# EAGLE schematic toyotune_3s_lvc_dil28 (EAGLE 5.11)

## Sheet 1 of 4
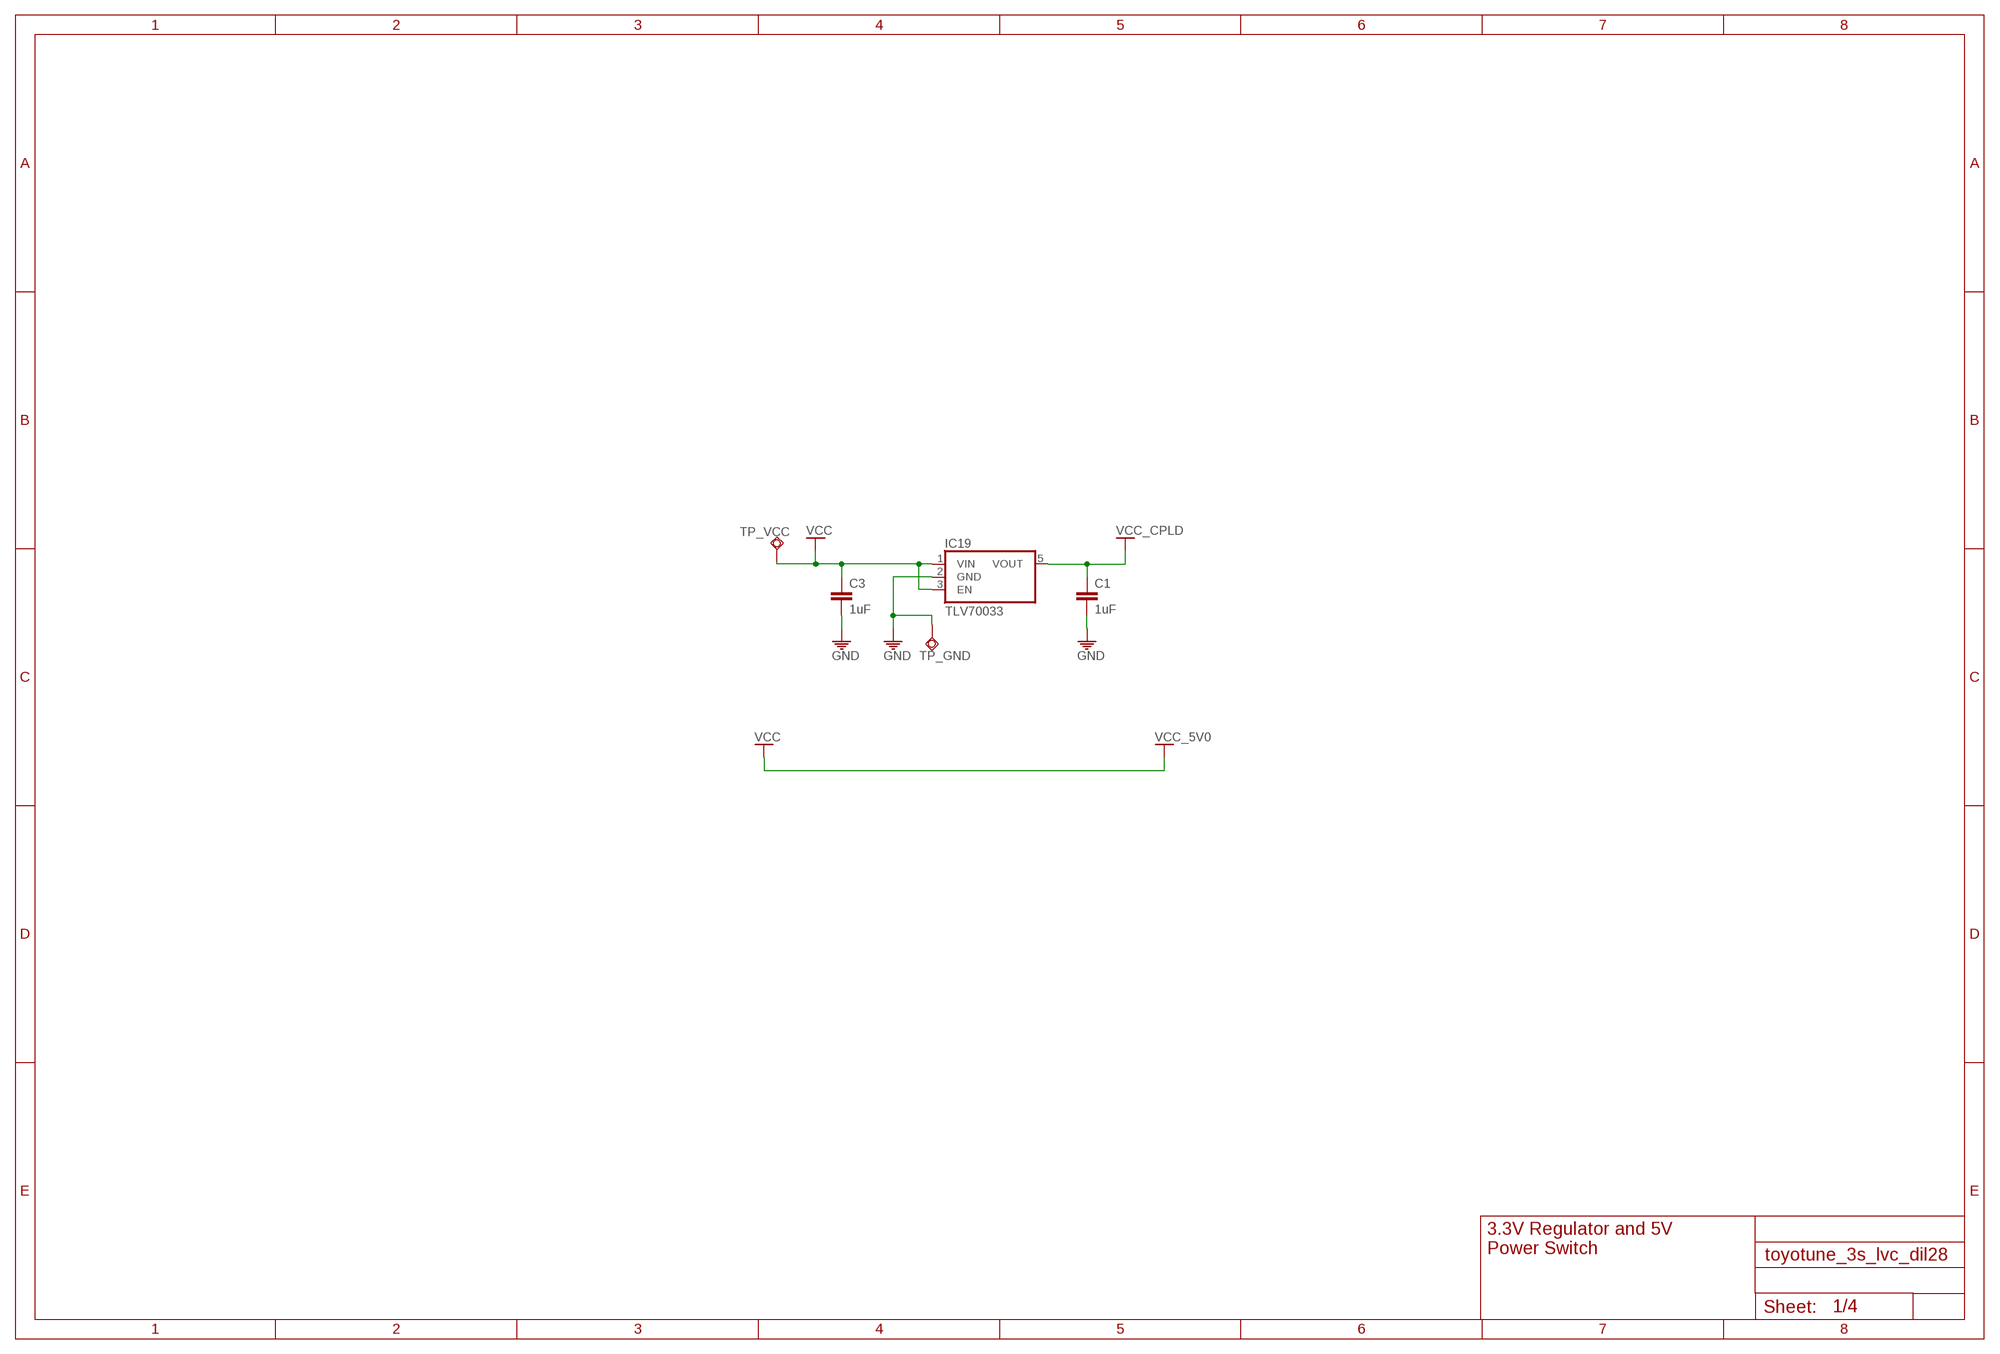
[diagram p0: schematic, sheet 1]

### Parts
C1  1uF  C-EUC0603  [C0603]
C3  1uF  C-EUC0603  [C0603]
IC19  TLV70033  [DDC_R-PDSO-G5]
TP_GND  TPSQTP12SQ  [TP12SQ]
TP_VCC  TPSQTP12SQ  [TP12SQ]

### Nets
GND: C1.2 C3.2 IC19.2(GND) TP_GND.TP ; also sheet 2,3,4
VCC: C3.1 IC19.1(VIN) IC19.3(EN) TP_VCC.TP ; supply symbol labelled VCC_5V0 ; also sheet 2,3,4
VCC_CPLD: C1.1 IC19.5(VOUT) ; also sheet 3,4

### Notes on the sheet
- 3.3V Regulator and 5V
- Power Switch

## Sheet 2 of 4
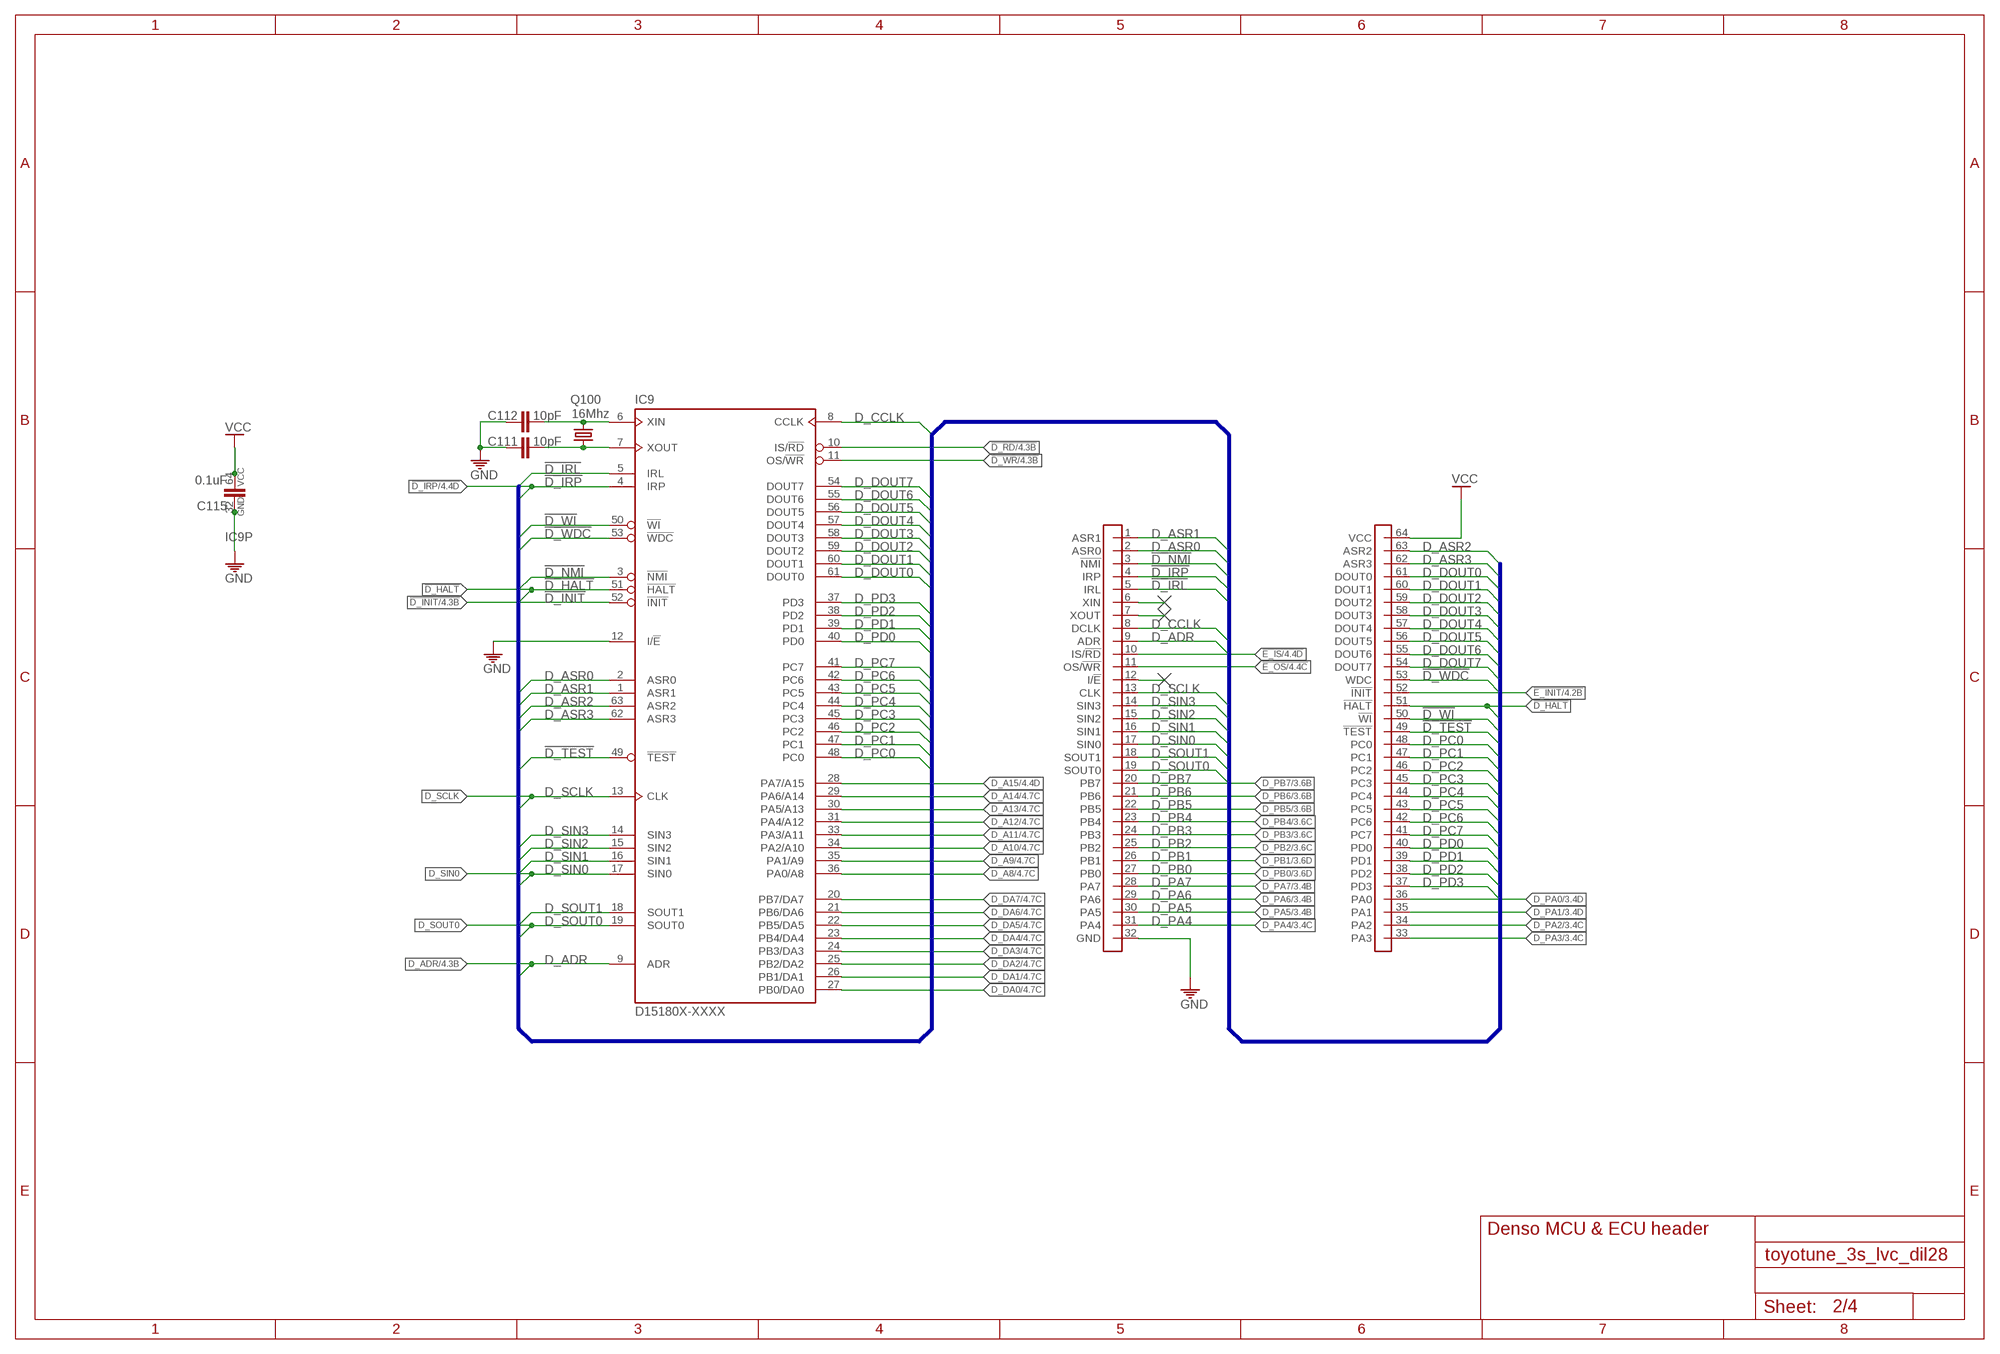
[diagram p1: schematic, sheet 2]

### Parts
C111  10pF  C-EUC0603  [C0603]
C112  10pF  C-EUC0603  [C0603]
C115  0.1uF  C-EUC0603  [C0603]
IC9  D15180X-XXXX  D151803-9661  [SDIP-64]
Q100  16Mhz  CRYSTAL5X3  [CRYSTAL-SMD-5X3]
U1  D151803-CONN  [SDIP-64-CONN]

### Nets
!D_HALT: IC9.51(:!HALT) U1.51(!HALT)
!D_INIT: IC9.52(:!INIT) ; also sheet 4
!D_IRL: IC9.5(:IRL) U1.5(IRL)
!D_IRP: IC9.4(:IRP) U1.4(IRP) ; also sheet 4
!D_NMI: IC9.3(:!NMI) U1.3(!NMI)
!D_RD: IC9.10(:IS/!RD) ; also sheet 4
!D_TEST: IC9.49(:!TEST) U1.49(!TEST)
!D_WDC: IC9.53(:!WDC) U1.53(WDC)
!D_WI: IC9.50(:!WI) U1.50(!WI)
!D_WR: IC9.11(:OS/!WR) ; also sheet 4
!E_INIT: U1.52(!INIT) ; also sheet 4
!E_IS: U1.10(IS/!RD) ; also sheet 4
!E_OS: U1.11(OS/!WR) ; also sheet 4
D1_XIN: C112.2 IC9.6(:XIN) Q100.3
D1_XOUT: C111.1 IC9.7(:XOUT) Q100.1
D_A8: IC9.36(:PA0/A8) ; also sheet 4
D_A9: IC9.35(:PA1/A9) ; also sheet 4
D_A10: IC9.34(:PA2/A10) ; also sheet 4
D_A11: IC9.33(:PA3/A11) ; also sheet 4
D_A12: IC9.31(:PA4/A12) ; also sheet 4
D_A13: IC9.30(:PA5/A13) ; also sheet 4
D_A14: IC9.29(:PA6/A14) ; also sheet 4
D_A15: IC9.28(:PA7/A15) ; also sheet 4
D_ADR: IC9.9(:ADR) U1.9(ADR) ; also sheet 4
D_ASR0: IC9.2(:ASR0) U1.2(ASR0)
D_ASR1: IC9.1(:ASR1) U1.1(ASR1)
D_ASR2: IC9.63(:ASR2) U1.63(ASR2)
D_ASR3: IC9.62(:ASR3) U1.62(ASR3)
D_CCLK: IC9.8(:CCLK) U1.8(DCLK) ; also sheet 4
D_DA0: IC9.27(:PB0/DA0) ; also sheet 4
D_DA1: IC9.26(:PB1/DA1) ; also sheet 4
D_DA2: IC9.25(:PB2/DA2) ; also sheet 4
D_DA3: IC9.24(:PB3/DA3) ; also sheet 4
D_DA4: IC9.23(:PB4/DA4) ; also sheet 4
D_DA5: IC9.22(:PB5/DA5) ; also sheet 4
D_DA6: IC9.21(:PB6/DA6) ; also sheet 4
D_DA7: IC9.20(:PB7/DA7) ; also sheet 4
D_DOUT0: IC9.61(:DOUT0) U1.61(DOUT0)
D_DOUT1: IC9.60(:DOUT1) U1.60(DOUT1)
D_DOUT2: IC9.59(:DOUT2) U1.59(DOUT2)
D_DOUT3: IC9.58(:DOUT3) U1.58(DOUT3)
D_DOUT4: IC9.57(:DOUT4) U1.57(DOUT4)
D_DOUT5: IC9.56(:DOUT5) U1.56(DOUT5)
D_DOUT6: IC9.55(:DOUT6) U1.55(DOUT6)
D_DOUT7: IC9.54(:DOUT7) U1.54(DOUT7)
D_PA0: U1.36(PA0) ; also sheet 3
D_PA1: U1.35(PA1) ; also sheet 3
D_PA2: U1.34(PA2) ; also sheet 3
D_PA3: U1.33(PA3) ; also sheet 3
D_PA4: U1.31(PA4) ; also sheet 3
D_PA5: U1.30(PA5) ; also sheet 3
D_PA6: U1.29(PA6) ; also sheet 3
D_PA7: U1.28(PA7) ; also sheet 3
D_PB0: U1.27(PB0) ; also sheet 3
D_PB1: U1.26(PB1) ; also sheet 3
D_PB2: U1.25(PB2) ; also sheet 3
D_PB3: U1.24(PB3) ; also sheet 3
D_PB4: U1.23(PB4) ; also sheet 3
D_PB5: U1.22(PB5) ; also sheet 3
D_PB6: U1.21(PB6) ; also sheet 3
D_PB7: U1.20(PB7) ; also sheet 3
D_PC0: IC9.48(:PC0) U1.48(PC0)
D_PC1: IC9.47(:PC1) U1.47(PC1)
D_PC2: IC9.46(:PC2) U1.46(PC2)
D_PC3: IC9.45(:PC3) U1.45(PC3)
D_PC4: IC9.44(:PC4) U1.44(PC4)
D_PC5: IC9.43(:PC5) U1.43(PC5)
D_PC6: IC9.42(:PC6) U1.42(PC6)
D_PC7: IC9.41(:PC7) U1.41(PC7)
D_PD0: IC9.40(:PD0) U1.40(PD0)
D_PD1: IC9.39(:PD1) U1.39(PD1)
D_PD2: IC9.38(:PD2) U1.38(PD2)
D_PD3: IC9.37(:PD3) U1.37(PD3)
D_SCLK: IC9.13(:CLK) U1.13(CLK)
D_SIN0: IC9.17(:SIN0) U1.17(SIN0)
D_SIN1: IC9.16(:SIN1) U1.16(SIN1)
D_SIN2: IC9.15(:SIN2) U1.15(SIN2)
D_SIN3: IC9.14(:SIN3) U1.14(SIN3)
D_SOUT0: IC9.19(:SOUT0) U1.19(SOUT0)
D_SOUT1: IC9.18(:SOUT1) U1.18(SOUT1)
GND: C111.2 C112.1 C115.1 IC9.12(:I/!E) IC9.32(P:GND) U1.32(GND) ; also sheet 1,3,4
N$28: U1.6(XIN)
N$29: U1.7(XOUT)
N$30: U1.12(I/!E)
VCC: C115.2 IC9.64(P:VCC) U1.64(VCC) ; also sheet 1,3,4

### Buses
!D_IRL,!D_IRP,!D_WI,!D_WDC,!D_NMI,!D_HALT,!D1_INIT,D_ASR[0..3],!D_TEST,D_PC[0..7],D_PD[0..3],D_ADR,D_SIN[0..3],D_SOUT[0..1],D_SCLK,D_CCLK,D_DOUT[0..7]

### Notes on the sheet
- Denso MCU & ECU header

## Sheet 3 of 4
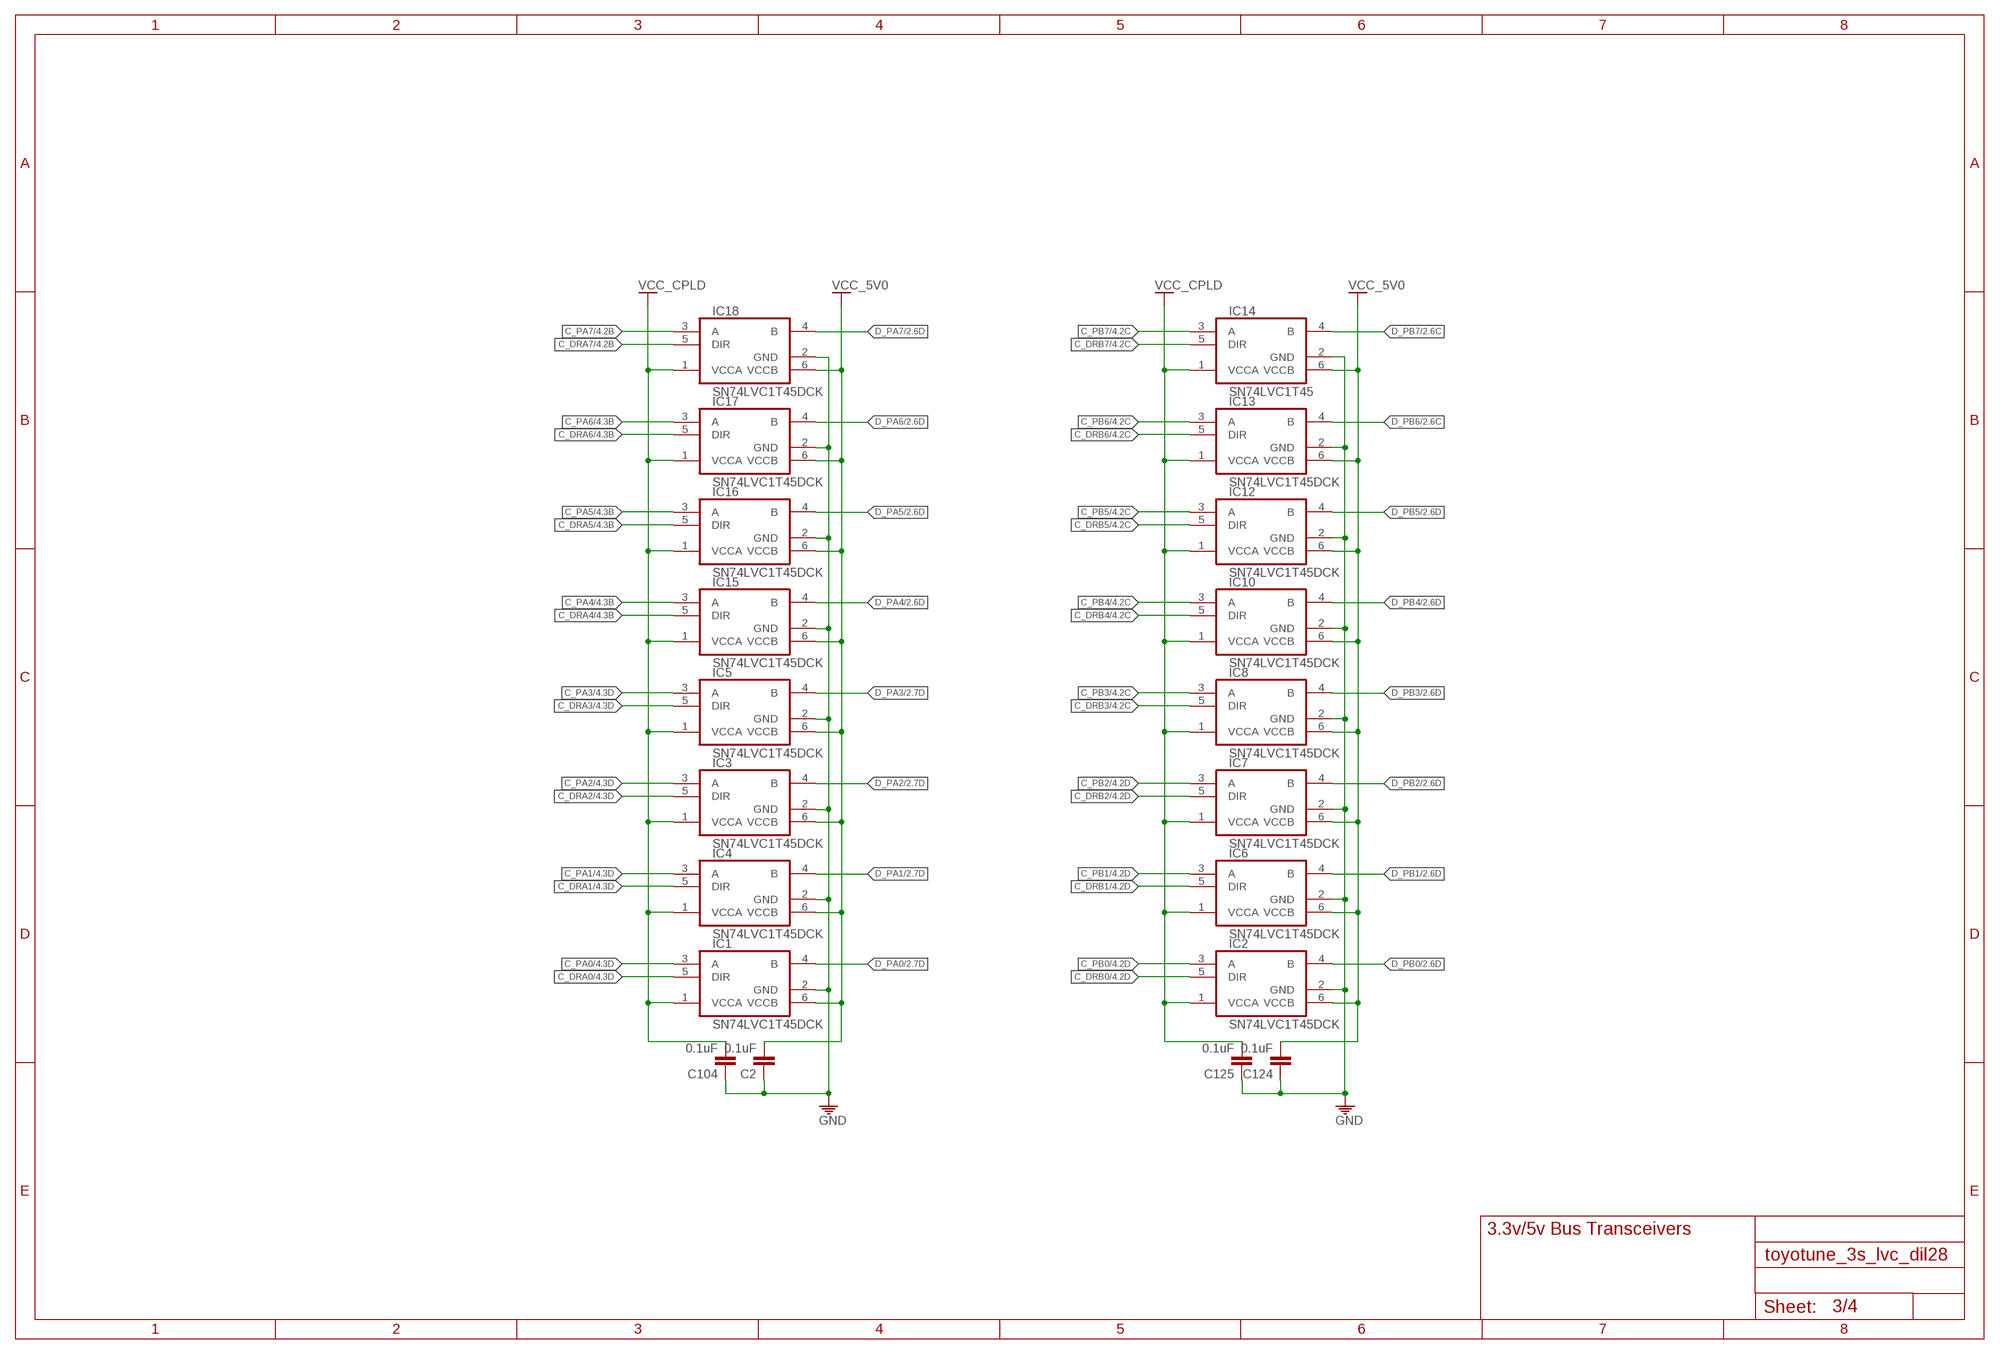
[diagram p2: schematic, sheet 3]

### Parts
C2  0.1uF  C-EUC0603  [C0603]
C104  0.1uF  C-EUC0603  [C0603]
C124  0.1uF  C-EUC0603  [C0603]
C125  0.1uF  C-EUC0603  [C0603]
IC1  SN74LVC1T45DCK  [DCK_R-PDSO-G6]
IC2  SN74LVC1T45DCK  [DCK_R-PDSO-G6]
IC3  SN74LVC1T45DCK  [DCK_R-PDSO-G6]
IC4  SN74LVC1T45DCK  [DCK_R-PDSO-G6]
IC5  SN74LVC1T45DCK  [DCK_R-PDSO-G6]
IC6  SN74LVC1T45DCK  [DCK_R-PDSO-G6]
IC7  SN74LVC1T45DCK  [DCK_R-PDSO-G6]
IC8  SN74LVC1T45DCK  [DCK_R-PDSO-G6]
IC10  SN74LVC1T45DCK  [DCK_R-PDSO-G6]
IC12  SN74LVC1T45DCK  [DCK_R-PDSO-G6]
IC13  SN74LVC1T45DCK  [DCK_R-PDSO-G6]
IC14  SN74LVC1T45  SN74LVC1T45DCK  [DCK_R-PDSO-G6]
IC15  SN74LVC1T45DCK  [DCK_R-PDSO-G6]
IC16  SN74LVC1T45DCK  [DCK_R-PDSO-G6]
IC17  SN74LVC1T45DCK  [DCK_R-PDSO-G6]
IC18  SN74LVC1T45DCK  [DCK_R-PDSO-G6]

### Nets
C_DRA0: IC1.5(DIR) ; also sheet 4
C_DRA1: IC4.5(DIR) ; also sheet 4
C_DRA2: IC3.5(DIR) ; also sheet 4
C_DRA3: IC5.5(DIR) ; also sheet 4
C_DRA4: IC15.5(DIR) ; also sheet 4
C_DRA5: IC16.5(DIR) ; also sheet 4
C_DRA6: IC17.5(DIR) ; also sheet 4
C_DRA7: IC18.5(DIR) ; also sheet 4
C_DRB0: IC2.5(DIR) ; also sheet 4
C_DRB1: IC6.5(DIR) ; also sheet 4
C_DRB2: IC7.5(DIR) ; also sheet 4
C_DRB3: IC8.5(DIR) ; also sheet 4
C_DRB4: IC10.5(DIR) ; also sheet 4
C_DRB5: IC12.5(DIR) ; also sheet 4
C_DRB6: IC13.5(DIR) ; also sheet 4
C_DRB7: IC14.5(DIR) ; also sheet 4
C_PA0: IC1.3(A) ; also sheet 4
C_PA1: IC4.3(A) ; also sheet 4
C_PA2: IC3.3(A) ; also sheet 4
C_PA3: IC5.3(A) ; also sheet 4
C_PA4: IC15.3(A) ; also sheet 4
C_PA5: IC16.3(A) ; also sheet 4
C_PA6: IC17.3(A) ; also sheet 4
C_PA7: IC18.3(A) ; also sheet 4
C_PB0: IC2.3(A) ; also sheet 4
C_PB1: IC6.3(A) ; also sheet 4
C_PB2: IC7.3(A) ; also sheet 4
C_PB3: IC8.3(A) ; also sheet 4
C_PB4: IC10.3(A) ; also sheet 4
C_PB5: IC12.3(A) ; also sheet 4
C_PB6: IC13.3(A) ; also sheet 4
C_PB7: IC14.3(A) ; also sheet 4
D_PA0: IC1.4(B) ; also sheet 2
D_PA1: IC4.4(B) ; also sheet 2
D_PA2: IC3.4(B) ; also sheet 2
D_PA3: IC5.4(B) ; also sheet 2
D_PA4: IC15.4(B) ; also sheet 2
D_PA5: IC16.4(B) ; also sheet 2
D_PA6: IC17.4(B) ; also sheet 2
D_PA7: IC18.4(B) ; also sheet 2
D_PB0: IC2.4(B) ; also sheet 2
D_PB1: IC6.4(B) ; also sheet 2
D_PB2: IC7.4(B) ; also sheet 2
D_PB3: IC8.4(B) ; also sheet 2
D_PB4: IC10.4(B) ; also sheet 2
D_PB5: IC12.4(B) ; also sheet 2
D_PB6: IC13.4(B) ; also sheet 2
D_PB7: IC14.4(B) ; also sheet 2
GND: C2.1 C104.1 C124.1 C125.1 IC1.2(GND) IC2.2(GND) IC3.2(GND) IC4.2(GND) IC5.2(GND) IC6.2(GND) IC7.2(GND) IC8.2(GND) IC10.2(GND) IC12.2(GND) IC13.2(GND) IC14.2(GND) IC15.2(GND) IC16.2(GND) IC17.2(GND) IC18.2(GND) ; also sheet 1,2,4
VCC: C2.2 C124.2 IC1.6(VCCB) IC2.6(VCCB) IC3.6(VCCB) IC4.6(VCCB) IC5.6(VCCB) IC6.6(VCCB) IC7.6(VCCB) IC8.6(VCCB) IC10.6(VCCB) IC12.6(VCCB) IC13.6(VCCB) IC14.6(VCCB) IC15.6(VCCB) IC16.6(VCCB) IC17.6(VCCB) IC18.6(VCCB) ; supply symbol labelled VCC_5V0 ; also sheet 1,2,4
VCC_CPLD: C104.2 C125.2 IC1.1(VCCA) IC2.1(VCCA) IC3.1(VCCA) IC4.1(VCCA) IC5.1(VCCA) IC6.1(VCCA) IC7.1(VCCA) IC8.1(VCCA) IC10.1(VCCA) IC12.1(VCCA) IC13.1(VCCA) IC14.1(VCCA) IC15.1(VCCA) IC16.1(VCCA) IC17.1(VCCA) IC18.1(VCCA) ; also sheet 1,4

### Notes on the sheet
- 3.3v/5v Bus Transceivers

## Sheet 4 of 4
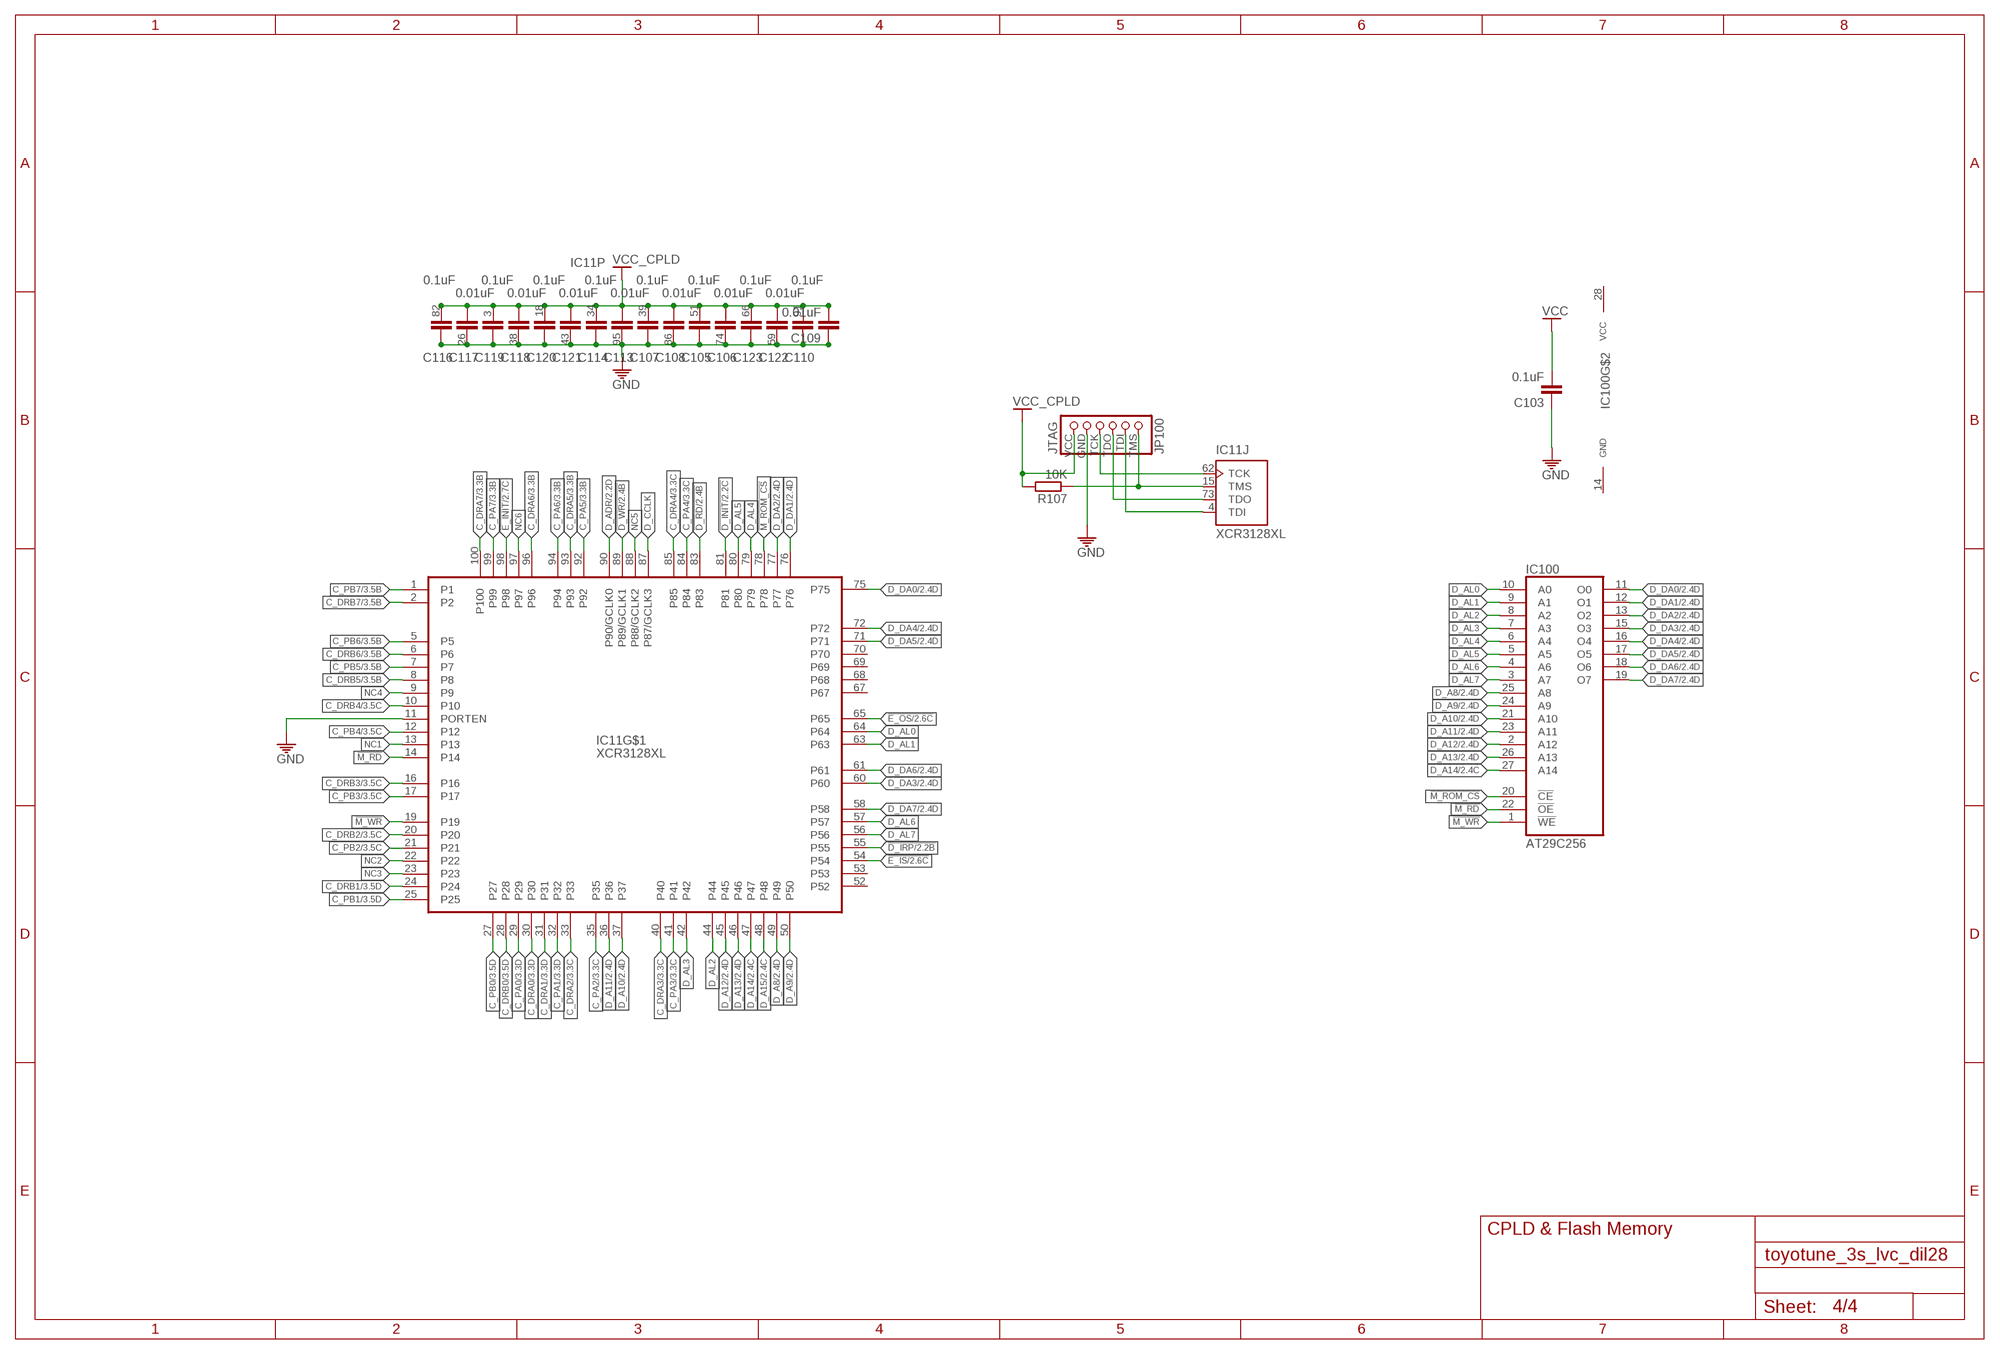
[diagram p3: schematic, sheet 4]

### Parts
C103  0.1uF  C-EUC0603  [C0603]
C105  0.1uF  C-EUC0603  [C0603]
C106  0.01uF  C-EUC0603  [C0603]
C107  0.1uF  C-EUC0603  [C0603]
C108  0.01uF  C-EUC0603  [C0603]
C109  0.01uF  C-EUC0603  [C0603]
C110  0.1uF  C-EUC0603  [C0603]
C113  0.01uF  C-EUC0603  [C0603]
C114  0.1uF  C-EUC0603  [C0603]
C116  0.1uF  C-EUC0603  [C0603]
C117  0.01uF  C-EUC0603  [C0603]
C118  0.01uF  C-EUC0603  [C0603]
C119  0.1uF  C-EUC0603  [C0603]
C120  0.1uF  C-EUC0603  [C0603]
C121  0.01uF  C-EUC0603  [C0603]
C122  0.01uF  C-EUC0603  [C0603]
C123  0.1uF  C-EUC0603  [C0603]
IC11  XCR3128XL  [VQ100]
IC100  AT29C256  [PDIP28]
JP100  JTAG  JTAG_HEADERS  [1X06_SMD]
R107  10K  R-EU_R0603  [R0603]

### Nets
!D_INIT: IC11.81 ; also sheet 2
!D_IRP: IC11.55 ; also sheet 2
!D_RD: IC11.83 ; also sheet 2
!D_WR: IC11.89(P89/GCLK1) ; also sheet 2
!E_INIT: IC11.98 ; also sheet 2
!E_IS: IC11.54 ; also sheet 2
!E_OS: IC11.65 ; also sheet 2
!M_RD: IC11.14 IC100.22(!OE)
!M_ROM_CS: IC11.78 IC100.20(!CE)
!M_WR: IC11.19 IC100.1(!WE)
C_DRA0: IC11.30 ; also sheet 3
C_DRA1: IC11.31 ; also sheet 3
C_DRA2: IC11.33 ; also sheet 3
C_DRA3: IC11.40 ; also sheet 3
C_DRA4: IC11.85 ; also sheet 3
C_DRA5: IC11.93 ; also sheet 3
C_DRA6: IC11.96 ; also sheet 3
C_DRA7: IC11.100 ; also sheet 3
C_DRB0: IC11.28 ; also sheet 3
C_DRB1: IC11.24 ; also sheet 3
C_DRB2: IC11.20 ; also sheet 3
C_DRB3: IC11.16 ; also sheet 3
C_DRB4: IC11.10 ; also sheet 3
C_DRB5: IC11.8 ; also sheet 3
C_DRB6: IC11.6 ; also sheet 3
C_DRB7: IC11.2 ; also sheet 3
C_PA0: IC11.29 ; also sheet 3
C_PA1: IC11.32 ; also sheet 3
C_PA2: IC11.35 ; also sheet 3
C_PA3: IC11.41 ; also sheet 3
C_PA4: IC11.84 ; also sheet 3
C_PA5: IC11.92 ; also sheet 3
C_PA6: IC11.94 ; also sheet 3
C_PA7: IC11.99 ; also sheet 3
C_PB0: IC11.27 ; also sheet 3
C_PB1: IC11.25 ; also sheet 3
C_PB2: IC11.21 ; also sheet 3
C_PB3: IC11.17 ; also sheet 3
C_PB4: IC11.12 ; also sheet 3
C_PB5: IC11.7 ; also sheet 3
C_PB6: IC11.5 ; also sheet 3
C_PB7: IC11.1 ; also sheet 3
D_A8: IC11.49 IC100.25(A8) ; also sheet 2
D_A9: IC11.50 IC100.24(A9) ; also sheet 2
D_A10: IC11.37 IC100.21(A10) ; also sheet 2
D_A11: IC11.36 IC100.23(A11) ; also sheet 2
D_A12: IC11.45 IC100.2(A12) ; also sheet 2
D_A13: IC11.46 IC100.26(A13) ; also sheet 2
D_A14: IC11.47 IC100.27(A14) ; also sheet 2
D_A15: IC11.48 ; also sheet 2
D_ADR: IC11.90(P90/GCLK0) ; also sheet 2
D_AL0: IC11.64 IC100.10(A0)
D_AL1: IC11.63 IC100.9(A1)
D_AL2: IC11.44 IC100.8(A2)
D_AL3: IC11.42 IC100.7(A3)
D_AL4: IC11.79 IC100.6(A4)
D_AL5: IC11.80 IC100.5(A5)
D_AL6: IC11.57 IC100.4(A6)
D_AL7: IC11.56 IC100.3(A7)
D_CCLK: IC11.87(P87/GCLK3) ; also sheet 2
D_DA0: IC11.75 IC100.11(O0) ; also sheet 2
D_DA1: IC11.76 IC100.12(O1) ; also sheet 2
D_DA2: IC11.77 IC100.13(O2) ; also sheet 2
D_DA3: IC11.60 IC100.15(O3) ; also sheet 2
D_DA4: IC11.72 IC100.16(O4) ; also sheet 2
D_DA5: IC11.71 IC100.17(O5) ; also sheet 2
D_DA6: IC11.61 IC100.18(O6) ; also sheet 2
D_DA7: IC11.58 IC100.19(O7) ; also sheet 2
GND: C103.1 C105.1 C106.1 C107.1 C108.1 C109.1 C110.1 C113.1 C114.1 C116.1 C117.1 C118.1 C119.1 C120.1 C121.1 C122.1 C123.1 IC11.11(PORTEN) IC11.26(P:GND) IC11.38(P:GND) IC11.43(P:GND) IC11.59(P:GND) IC11.74(P:GND) IC11.86(P:GND) IC11.95(P:GND) JP100.GND ; also sheet 1,2,3
NC1: IC11.13
NC2: IC11.22
NC3: IC11.23
NC4: IC11.9
NC5: IC11.88(P88/GCLK2)
NC6: IC11.97
TCK: IC11.62(J:TCK) JP100.TCK
TDI: IC11.4(J:TDI) JP100.TDI
TDO: IC11.73(J:TDO) JP100.TDO
TMS: IC11.15(J:TMS) JP100.TMS R107.1
VCC: C103.2 ; also sheet 1,2,3
VCC_CPLD: C105.2 C106.2 C107.2 C108.2 C109.2 C110.2 C113.2 C114.2 C116.2 C117.2 C118.2 C119.2 C120.2 C121.2 C122.2 C123.2 IC11.3(P:VCC_3V3) IC11.18(P:VCC_3V3) IC11.34(P:VCC_3V3) IC11.39(P:VCC_3V3) IC11.51(P:VCC_3V3) IC11.66(P:VCC_3V3) IC11.82(P:VCC_3V3) IC11.91(P:VCC_3V3) JP100.VCC R107.2 ; also sheet 1,3
Unconnected: IC11.52 IC11.53 IC11.67 IC11.68 IC11.69 IC11.70

### Notes on the sheet
- CPLD & Flash Memory

## Power pins joined to a net without a drawn wire
GND: IC100.14(GND)
VCC: IC100.28(VCC)

## Library data of the parts
C1-C3 C103-C125 = toyotune:C-EU: CAPACITOR, European symbol
IC1-IC8 IC10 IC12-IC18 = toyotune:SN74LVC1T45
IC9 = toyota-ecu:D151803-9661
IC11 = toyota-ecu:XCR3128XL
IC19 = toyota-ecu:TLV70033
IC100 = toyotune:AT29C256
JP100 = toyotune:JTAG_HEADER: PIN HEADER
Q100 = toyota-ecu:CRYSTAL: Crystals Various standard crystals. Proven footprints. Spark Fun Electronics SKU : COM-00534
R107 = toyotune:R-EU_: RESISTOR, European symbol
TP_GND TP_VCC = testpad:TPSQ: Test pad
U1 = toyotune:D151803-CONN